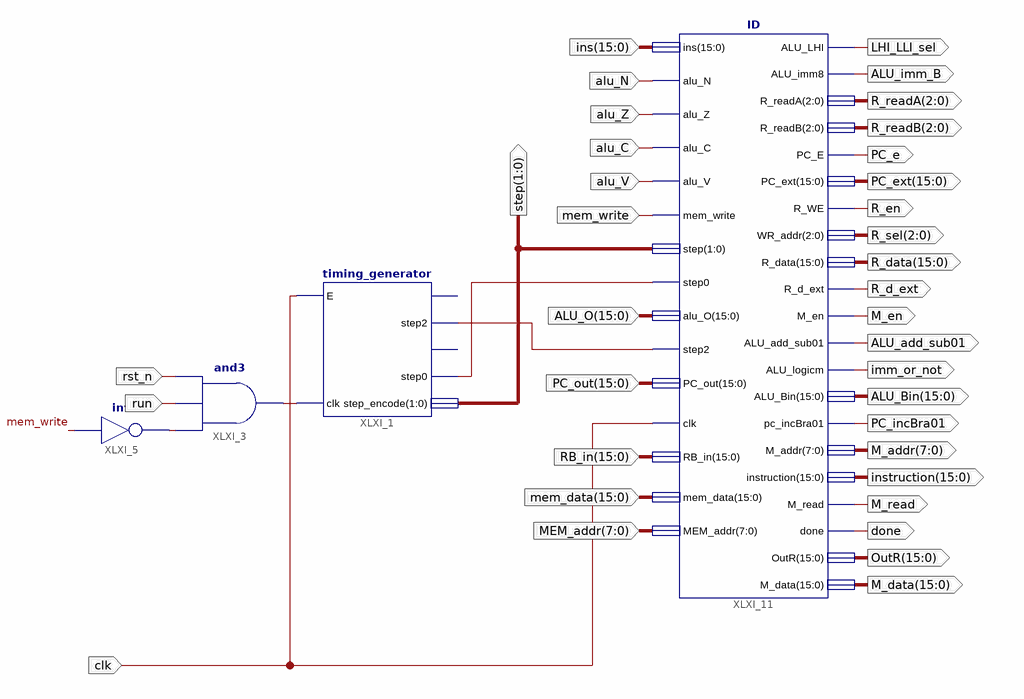
[diagram p0: schematic sheet 1]
// Xilinx ISE schematic controller.sch (spartan6) as structural Verilog: 4 symbols, 36 ports
module controller (
  input  mem_write,
  input  rst_n,
  input  run,
  input  clk,
  input  [15:0] ins,
  input  alu_N,
  input  alu_Z,
  input  alu_C,
  input  alu_V,
  input  [15:0] ALU_O,
  input  [15:0] PC_out,
  input  [15:0] RB_in,
  input  [15:0] mem_data,
  input  [7:0] MEM_addr,
  output [15:0] OutR,
  output done,
  output M_read,
  output [15:0] instruction,
  output [7:0] M_addr,
  output PC_incBra01,
  output [15:0] ALU_Bin,
  output imm_or_not,
  output ALU_add_sub01,
  output M_en,
  output R_d_ext,
  output [15:0] R_data,
  output [2:0] R_sel,
  output R_en,
  output [15:0] PC_ext,
  output PC_e,
  output [2:0] R_readB,
  output [2:0] R_readA,
  output ALU_imm_B,
  output LHI_LLI_sel,
  output [1:0] step,
  output [15:0] M_data
);

  wire XLXN_4, XLXN_6, XLXN_21, XLXN_22;

  timing_generator XLXI_1 (
    .E(clk), .clk(XLXN_4), .step2(XLXN_22), .step0(XLXN_21), .step_encode(step));  // open: step3, step1
  and XLXI_3 (XLXN_4, XLXN_6, run, rst_n);
  not XLXI_5 (XLXN_6, mem_write);
  ID XLXI_11 (
    .ins(ins), .alu_N(alu_N), .alu_Z(alu_Z), .alu_C(alu_C), .alu_V(alu_V), .mem_write(mem_write),
    .step(step), .step0(XLXN_21), .step2(XLXN_22), .alu_O(ALU_O), .PC_out(PC_out), .clk(clk), .RB_in(RB_in),
    .MEM_addr(MEM_addr), .mem_data(mem_data), .instruction(instruction), .M_read(M_read), .done(done),
    .OutR(OutR), .M_data(M_data), .ALU_LHI(LHI_LLI_sel), .ALU_imm8(ALU_imm_B), .R_readA(R_readA),
    .R_readB(R_readB), .PC_E(PC_e), .PC_ext(PC_ext), .R_WE(R_en), .WR_addr(R_sel), .R_data(R_data),
    .R_d_ext(R_d_ext), .M_en(M_en), .ALU_add_sub01(ALU_add_sub01), .ALU_logicm(imm_or_not),
    .ALU_Bin(ALU_Bin), .pc_incBra01(PC_incBra01), .M_addr(M_addr));
endmodule
